# EAGLE design Atom S3 Module - Rev. C (EAGLE 9.6.2)

## Sheet 1 of 2: Power
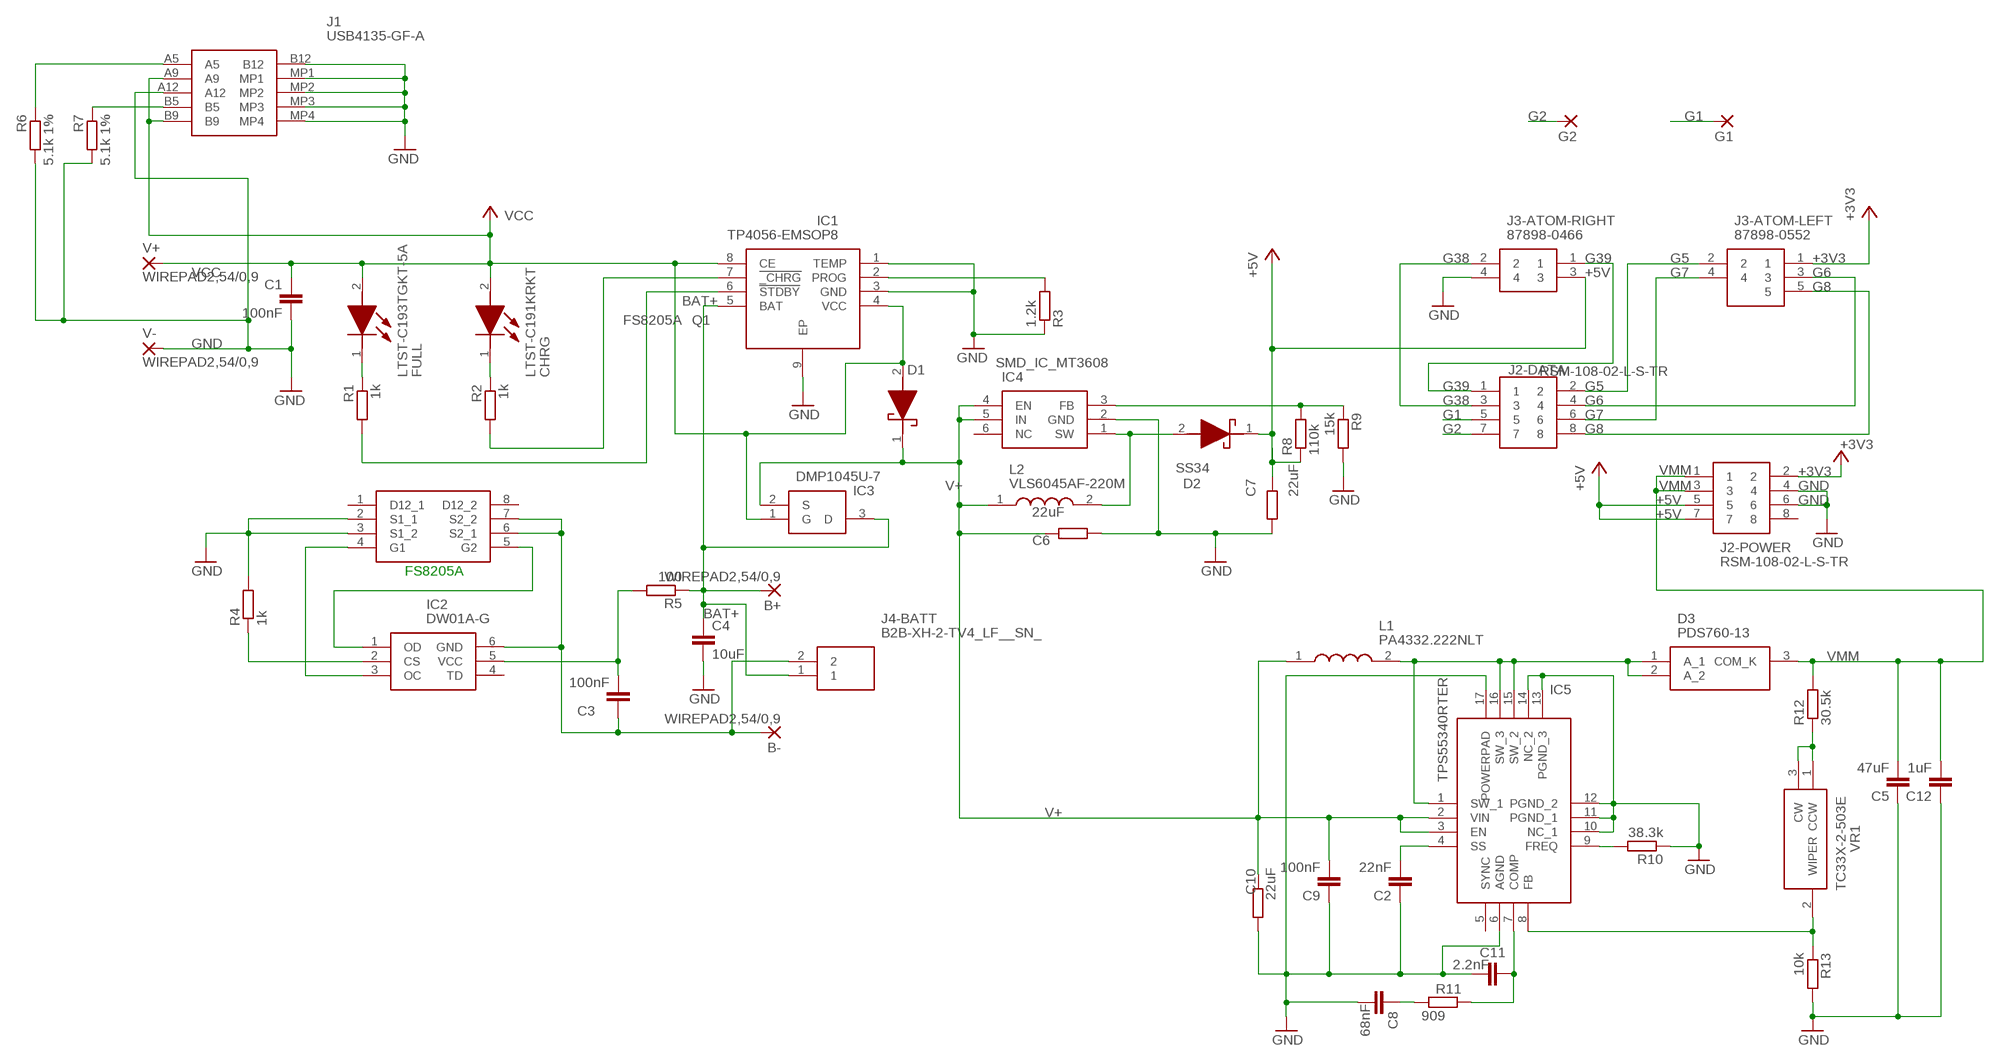
[diagram p0: schematic, sheet 1]

### Parts
B+  WIREPAD2,54/0,9  [2,54/0,9]
B-  WIREPAD2,54/0,9  [2,54/0,9]
C1  100nF  C-EUC0603  [C0603]
C2  22nF  C-EUC0603  [C0603]
C3  100nF  C-EUC0603  [C0603]
C4  10uF  C-EUC0603  [C0603]
C5  47uF  C-EUC1210  [C1210]
C6  22uF  R-EU_R0805  [R0805]
C7  22uF  R-EU_R0805  [R0805]
C8  68nF  C-EUC0603  [C0603]
C9  100nF  C-EUC0603  [C0603]
C10  22uF  R-EU_R0805  [R0805]
C11  2.2nF  C-EUC0603  [C0603]
C12  1uF  C-EUC0603  [C0603]
CHRG  LTST-C191KRKT  [LEDC1608X55N]
D1  SS34  [DIOM8059X256N]
D2  SS34  [DIOM8059X256N]
D3  PDS760-13  [PDS76013]
FULL  LTST-C193TGKT-5A  [LEDC1608X45N]
G1  WIREPAD1,6/0,9  [1,6/0,9]
G2  WIREPAD1,6/0,9  [1,6/0,9]
IC1  TP4056-EMSOP8  [SOP65P490X110-9N]
IC2  DW01A-G  [SOT95P190X145-6N]
IC3  DMP1045U-7  [SOT96P240X110-3N]
IC4  SMD_IC_MT3608  [SOT95P280X145-6N]
IC5  TPS55340RTER  [QFN50P300X300X80-17N]
J1  USB4135-GF-A  [USB4135GFA]
J2-DATA  RSM-108-02-L-S-TR  [RSM10802LSTR]
J2-POWER  RSM-108-02-L-S-TR  [RSM10802LSTR]
J3-ATOM-LEFT  87898-0552  [878980552]
J3-ATOM-RIGHT  87898-0466  [878980466]
J4-BATT  B2B-XH-2-TV4_LF__SN_  [B2BXH2TV4LFSN]
L1  PA4332.222NLT  [INDPM4042X200N]
L2  VLS6045AF-220M  [VLS6045]
Q1  FS8205A  [SOP65P640X120-8N]
R1  1k  R-EU_R0603  [R0603]
R2  1k  R-EU_R0603  [R0603]
R3  1.2k  R-EU_R0603  [R0603]
R4  1k  R-EU_R0603  [R0603]
R5  100  R-EU_R0603  [R0603]
R6  5.1k 1%  R-EU_R0603  [R0603]
R7  5.1k 1%  R-EU_R0603  [R0603]
R8  110k  R-EU_R0603  [R0603]
R9  15k  R-EU_R0603  [R0603]
R10  38.3k  R-EU_R0603  [R0603]
R11  909  R-EU_R0603  [R0603]
R12  30.5k  R-EU_R0805  [R0805]
R13  10k  R-EU_R0603  [R0603]
V+  WIREPAD2,54/0,9  [2,54/0,9]
V-  WIREPAD2,54/0,9  [2,54/0,9]
VR1  TC33X-2-503E  [TC33X2503E]

### Nets
+3V3: J2-POWER.2 J3-ATOM-LEFT.1
+5V [Power]: C7.2 D2.1(K) J2-POWER.5 J2-POWER.7 J3-ATOM-RIGHT.3 R8.1
BAT+ [Power]: B+.1(P) C4.1 IC1.5(BAT) IC3.3(D) J4-BATT.1 R5.1
BAT- [Power]: B-.1(P) C3.1 IC2.6(GND) J4-BATT.2 Q1.6(S2_1) Q1.7(S2_2)
G1: G1.1(P) J2-DATA.5
G2: G2.1(P) J2-DATA.7
G5: J2-DATA.2 J3-ATOM-LEFT.2
G6: J2-DATA.4 J3-ATOM-LEFT.3
G7: J2-DATA.6 J3-ATOM-LEFT.4
G8: J2-DATA.8 J3-ATOM-LEFT.5
G38: J2-DATA.3 J3-ATOM-RIGHT.2
G39: J2-DATA.1 J3-ATOM-RIGHT.1
GND [GND]: C1.2 C2.1 C4.2 C5.1 C6.1 C7.1 C8.2 C9.1 C10.1 C11.2 C12.1 IC1.1(TEMP) IC1.3(GND) IC1.9(EP) IC4.2(GND) IC5.6(AGND) IC5.10(NC_1) IC5.11(PGND_1) IC5.12(PGND_2) IC5.13(PGND_3) IC5.14(NC_2) IC5.17(POWERPAD) J1.A12 J1.B12 J1.MP1 J1.MP2 J1.MP3 J1.MP4 J2-POWER.4 J2-POWER.6 J3-ATOM-RIGHT.4 Q1.2(S1_1) Q1.3(S1_2) R3.1 R4.2 R6.2 R7.2 R9.2 R10.1 R13.2 V-.1(P)
N$1: FULL.1(K) R1.1
N$2: CHRG.1(K) R2.1
N$3: IC1.6(!STDBY) R1.2
N$4: IC1.7(!_CHRG) R2.2
N$5: IC2.3(OC) Q1.4(G1)
N$6: J1.B5 R7.1
N$7: IC1.2(PROG) R3.2
N$8: IC2.2(CS) R4.1
N$9: IC2.1(OD) Q1.5(G2)
N$10: D2.2(A) IC4.1(SW) L2.2
N$11: C3.2 IC2.5(VCC) R5.2
N$15: J1.A5 R6.1
N$16: IC5.9(FREQ) R10.2
N$17: IC4.3(FB) R8.2 R9.1
N$18: C11.1 IC5.7(COMP) R11.2
N$19: C8.1 R11.1
N$20: D3.1(A_1) D3.2(A_2) IC5.1(SW_1) IC5.15(SW_2) IC5.16(SW_3) L1.2
N$21: C2.2 IC5.4(SS)
N$24: R12.1 VR1.1(CCW) VR1.3(CW)
N$25: IC5.8(FB) R13.1 VR1.2(WIPER)
V+ [Power]: C6.2 C9.2 C10.2 D1.1(K) IC3.2(S) IC4.4(EN) IC4.5(IN) IC5.2(VIN) IC5.3(EN) L1.1 L2.1
VCC [Power]: C1.1 CHRG.2(A) D1.2(A) FULL.2(A) IC1.4(VCC) IC1.8(CE) IC3.1(G) J1.A9 J1.B9 V+.1(P)
VMM [Power]: C5.2 C12.2 D3.3(COM_K) J2-POWER.1 J2-POWER.3 R12.2
Unconnected: IC2.4(TD) IC4.6(NC) IC5.5(SYNC) J2-POWER.8 Q1.1(D12_1) Q1.8(D12_2)

### Notes on the sheet
- FS8205A

## Sheet 2 of 2

## Library data of the parts
B+ B- G1 G2 V+ V- = wirepad:WIREPAD: Wire PAD connect wire on PCB
C1-C5 C8 C9 C11 C12 = rcl:C-EU: CAPACITOR, European symbol; SPICEPREFIX: C
C6 C7 C10 R1-R13 = rcl:R-EU_: RESISTOR, European symbol; SPICEPREFIX: R
CHRG = SamacSys_Parts:LTST-C191KRKT: Standard LEDs - SMD Red Clear 631nm Source: Datasheet; DESCRIPTION: Standard LEDs - SMD Red Clear 631nm; HEIGHT: 0.55mm; MANUFACTURER_NAME: Lite-On; MANUFACTURER_PART_NUMBER: LTST-C191KRKT; MOUSER_PART_NUMBER: 859-LTST-C191KRKT; MOUSER_PRICE-STOCK: https://www.mouser.co.uk/ProductDetail/Lite-On/LTST-C191KRKT?qs=BAIUz4Y8PJBLfOhzue0q%252BA%3D%3D
D1 D2 = SamacSys_Parts:SS34: ON Semi SS34 SMT Schottky Diode, 40V 3A, 2-Pin DO-214AB Source: Datasheet <https://componentsearchengine.com/Datasheets/2/SS34.pdf>; DESCRIPTION: ON Semi SS34 SMT Schottky Diode, 40V 3A, 2-Pin DO-214AB; HEIGHT: 2.56mm; MANUFACTURER_NAME: onsemi; MANUFACTURER_PART_NUMBER: SS34; MOUSER_PART_NUMBER: 512-SS34; MOUSER_PRICE-STOCK: https://www.mouser.co.uk/ProductDetail/onsemi-Fairchild/SS34?qs=2ONuHmP%2FXzb3ub11UdFfdQ%3D%3D
D3 = SamacSys_Parts:PDS760-13: Diode Schottky 60V 7A 3Pin PowerDI 5 Diodes Inc PDS760-13, SMT Schottky Diode, 60V 7A, 3-Pin PowerDI 5 Source: Datasheet <https://www.diodes.com/assets/Datasheets/PDS760.pdf>; DESCRIPTION: Diode Schottky 60V 7A 3Pin PowerDI 5 Diodes Inc PDS760-13, SMT Schottky Diode, 60V 7A, 3-Pin PowerDI 5; HEIGHT: 1.15mm; MANUFACTURER_NAME: Diodes Incorporated; MANUFACTURER_PART_NUMBER: PDS760-13; MOUSER_PART_NUMBER: 621-PDS760-F; MOUSER_PRICE-STOCK: https://www.mouser.co.uk/ProductDetail/Diodes-Incorporated/PDS760-13?qs=%2FNF5U5UGuWlxwy7NIrHVWQ%3D%3D
FULL = SamacSys_Parts:LTST-C193TGKT-5A: Standard LEDs - SMD Green 525nm 90mcd 5mA Source: Datasheet <https://componentsearchengine.com/Datasheets/1/LTST-C193TGKT-5A.pdf>; DESCRIPTION: Standard LEDs - SMD Green 525nm 90mcd 5mA; HEIGHT: 0.45mm; MANUFACTURER_NAME: Lite-On; MANUFACTURER_PART_NUMBER: LTST-C193TGKT-5A; MOUSER_PART_NUMBER: 859-LTSTC193TGKT5A; MOUSER_PRICE-STOCK: https://www.mouser.co.uk/ProductDetail/Lite-On/LTST-C193TGKT-5A?qs=xIkB7y1OTopTMREQeh9vRQ%3D%3D
IC1 = SamacSys_Parts:TP4056-EMSOP8: nc Source: Datasheet <http://pdf1.alldatasheet.co.kr/datasheet-pdf/view/1140415/ASIC/TP4056X.html>; DESCRIPTION: nc; HEIGHT: 1.1mm; MANUFACTURER_NAME: TOP POWER; MANUFACTURER_PART_NUMBER: TP4056-EMSOP8
IC2 = SamacSys_Parts:DW01A-G: one cell lithium-ion/polymer battery protection IC Source: Datasheet <http://www.ic-fortune.com/upload/Download/DW01x-DS-17_EN.pdf>; DESCRIPTION: one cell lithium-ion/polymer battery protection IC; HEIGHT: 1.45mm; MANUFACTURER_NAME: SII Semiconductor; MANUFACTURER_PART_NUMBER: DW01A-G
IC3 = SamacSys_Parts:DMP1045U-7: P-Channel Enhancement MOSFET SOT-23 Diodes Inc DMP1045U-7 P-channel MOSFET Transistor, 5.2 A, -12 V, 3-Pin SOT23 Source: Datasheet <https://www.diodes.com//assets/Datasheets/DMP1045U.pdf>; DESCRIPTION: P-Channel Enhancement MOSFET SOT-23 Diodes Inc DMP1045U-7 P-channel MOSFET Transistor, 5.2 A, -12 V, 3-Pin SOT23; HEIGHT: 1.1mm; MANUFACTURER_NAME: Diodes Incorporated; MANUFACTURER_PART_NUMBER: DMP1045U-7; MOUSER_PART_NUMBER: 621-DMP1045U-7; MOUSER_PRICE-STOCK: https://www.mouser.co.uk/ProductDetail/Diodes-Incorporated/DMP1045U-7?qs=T%2FOtf55vL7eEKnIWhgMvTQ%3D%3D
IC4 = SamacSys_Parts:SMD_IC_MT3608: Switching Voltage Regulators Source: Datasheet; DESCRIPTION: Switching Voltage Regulators; HEIGHT: 1.45mm; MANUFACTURER_NAME: Olimex Ltd.; MANUFACTURER_PART_NUMBER: SMD IC MT3608; MOUSER_PART_NUMBER: 909-SMDICMT3608; MOUSER_PRICE-STOCK: https://www.mouser.co.uk/ProductDetail/Olimex-Ltd/SMD-IC-MT3608?qs=9vOqFld9vZUPP7qbovoiPg%3D%3D
IC5 = SamacSys_Parts:TPS55340RTER: TEXAS INSTRUMENTS - TPS55340RTER - DC/DC CONV, BOOST/SEPIC/FLYBACK, WQFN-16 Source: Datasheet <http://www.ti.com/general/docs/lit/getliterature.tsp?genericPartNumber=TPS55340&&fileType=pdf>; DESCRIPTION: TEXAS INSTRUMENTS - TPS55340RTER - DC/DC CONV, BOOST/SEPIC/FLYBACK, WQFN-16; HEIGHT: 0.8mm; MANUFACTURER_NAME: Texas Instruments; MANUFACTURER_PART_NUMBER: TPS55340RTER; MOUSER_PART_NUMBER: 595-TPS55340RTER; MOUSER_PRICE-STOCK: https://www.mouser.co.uk/ProductDetail/Texas-Instruments/TPS55340RTER?qs=N%2FGwOzoYEAAx6J14jB%2FDAA%3D%3D
J1 = SamacSys_Parts:USB4135-GF-A: USB Connectors USBC Rec GF RA 6P SMT-SMT stakes 3.16mm Source: Datasheet; DESCRIPTION: USB Connectors USBC Rec GF RA 6P SMT-SMT stakes 3.16mm; HEIGHT: 3.5mm; MANUFACTURER_NAME: GCT (GLOBAL CONNECTOR TECHNOLOGY); MANUFACTURER_PART_NUMBER: USB4135-GF-A; MOUSER_PART_NUMBER: 640-USB4135-GF-A; MOUSER_PRICE-STOCK: https://www.mouser.co.uk/ProductDetail/GCT/USB4135-GF-A?qs=Li%252BoUPsLEnt6HRo6RUvaXA%3D%3D
J2-DATA J2-POWER = SamacSys_Parts:RSM-108-02-L-S-TR: SAMTEC - RSM-108-02-L-S-TR - PCB Receptacle, Board-to-Board, 1.27 mm, 1 Rows, 8 Contacts, Surface Mount, RSM Series Source: Datasheet <https://suddendocs.samtec.com/prints/rsm-1xx-xx-xxx-s-x-xx-mkt.pdf>; DESCRIPTION: SAMTEC - RSM-108-02-L-S-TR - PCB Receptacle, Board-to-Board, 1.27 mm, 1 Rows, 8 Contacts, Surface Mount, RSM Series; HEIGHT: 6.1mm; MANUFACTURER_NAME: SAMTEC; MANUFACTURER_PART_NUMBER: RSM-108-02-L-S-TR; MOUSER_PART_NUMBER: 200-RSM10802LSTR; MOUSER_PRICE-STOCK: https://www.mouser.co.uk/ProductDetail/Samtec/RSM-108-02-L-S-TR?qs=rU5fayqh%252BE1Z8VnVeAb3Xg%3D%3D
J3-ATOM-LEFT = SamacSys_Parts:87898-0552: Headers & Wire Housings 2.54MM SRSW SMT HDR W/CAPT&R .05AULF5P Source: Datasheet <https://www.molex.com/pdm_docs/sd/878980552_sd.pdf>; DESCRIPTION: Headers & Wire Housings 2.54MM SRSW SMT HDR W/CAPT&R .05AULF5P; HEIGHT: 11.01mm; MANUFACTURER_NAME: Molex; MANUFACTURER_PART_NUMBER: 87898-0552
J3-ATOM-RIGHT = SamacSys_Parts:87898-0466: Headers & Wire Housings 2.54mm SRSW SMT Hd r W/O Cap 2.5SnL 4P Source: Datasheet <https://www.molex.com/pdm_docs/sd/878980466_sd.pdf>; DESCRIPTION: Headers & Wire Housings 2.54mm SRSW SMT Hd r W/O Cap 2.5SnL 4P; HEIGHT: 13.1mm; MANUFACTURER_NAME: Molex; MANUFACTURER_PART_NUMBER: 87898-0466; MOUSER_PART_NUMBER: 538-87898-0466; MOUSER_PRICE-STOCK: https://www.mouser.co.uk/ProductDetail/Molex/87898-0466?qs=Jo8FxELueakLmWG61uYedg%3D%3D
J4-BATT = SamacSys_Parts:B2B-XH-2-TV4_LF__SN_: Headers & Wire Housings XA HEADER ON RADIAL-TAPE (TOP TYPE) Source: Datasheet <https://www.jst-mfg.com/product/pdf/eng/eXH.pdf?674952ddde4ec>; DESCRIPTION: Headers & Wire Housings XA HEADER ON RADIAL-TAPE (TOP TYPE); HEIGHT: 7mm; MANUFACTURER_NAME: JST (JAPAN SOLDERLESS TERMINALS); MANUFACTURER_PART_NUMBER: B2B-XH-2-TV4(LF)(SN); MOUSER_PART_NUMBER: 306-B2BXH2TV4LFSN; MOUSER_PRICE-STOCK: https://www.mouser.co.uk/ProductDetail/JST-Commercial/B2B-XH-2-TV4LFSN?qs=QpmGXVUTftF%2FGUlNCb6%252BgQ%3D%3D
L1 = SamacSys_Parts:PA4332.222NLT: Inductor Power Shielded Drum Core 2.2uH 20% 1MHz 4.3A 48mOhm DCR 1515 T/R Source: Datasheet <https://datasheet.datasheetarchive.com/originals/distributors/DKDS-10/182650.pdf>; DESCRIPTION: Inductor Power Shielded Drum Core 2.2uH 20% 1MHz 4.3A 48mOhm DCR 1515 T/R; HEIGHT: 2mm; MANUFACTURER_NAME: Pulse Electronics; MANUFACTURER_PART_NUMBER: PA4332.222NLT; MOUSER_PART_NUMBER: 673-PA4332222NLT; MOUSER_PRICE-STOCK: https://www.mouser.co.uk/ProductDetail/Pulse-Electronics/PA4332.222NLT?qs=%2FzQKu7YvIMbE5ttuY4d%2Fzg%3D%3D
L2 = SamacSys_Parts:VLS6045AF-220M: SMD / SMT Inductors (Coils), L=22?H, L x W x T : Source: Datasheet <https://product.tdk.com/system/files/dam/doc/product/inductor/inductor/smd/catalog/inductor_commercial_power_vls6045af_en.pdf>; DESCRIPTION: SMD / SMT Inductors (Coils), L=22?H, L x W x T :; HEIGHT: mm; MANUFACTURER_NAME: TDK; MANUFACTURER_PART_NUMBER: VLS6045AF-220M; MOUSER_PART_NUMBER: 810-VLS6045AF-220M; MOUSER_PRICE-STOCK: https://www.mouser.co.uk/ProductDetail/TDK/VLS6045AF-220M?qs=lc2O%252BfHJPVaPRXMBSSNqgw%3D%3D
Q1 = SamacSys_Parts:FS8205A: dual n-channel enhancement mode power MOFSET Source: Datasheet <http://www.ic-fortune.com/upload/Download/FS8205A-DS-12_EN.pdf>; DESCRIPTION: dual n-channel enhancement mode power MOFSET; HEIGHT: 1.2mm; MANUFACTURER_NAME: SII Semiconductor; MANUFACTURER_PART_NUMBER: FS8205A
VR1 = SamacSys_Parts:TC33X-2-503E: SMD single turn trimmer 50K 25% top adj Bourns TC33 Series SMD Trimmer Resistor with Solder Pad Terminations, 50k +/-25% 0.1W +/-250ppm/C Top Adjust Source: Datasheet <https://componentsearchengine.com/Datasheets/1/TC33X-2-503E.pdf>; DESCRIPTION: SMD single turn trimmer 50K 25% top adj Bourns TC33 Series SMD Trimmer Resistor with Solder Pad Terminations, 50k +/-25% 0.1W +/-250ppm/C Top Adjust; HEIGHT: 1.2mm; MANUFACTURER_NAME: Bourns; MANUFACTURER_PART_NUMBER: TC33X-2-503E; MOUSER_PART_NUMBER: 652-TC33X-2-503E; MOUSER_PRICE-STOCK: https://www.mouser.co.uk/ProductDetail/Bourns/TC33X-2-503E?qs=tEaODSGlU8NgxHjveDtEEg%3D%3D

## Net classes
2 Power: width 0.203 mm

## Board
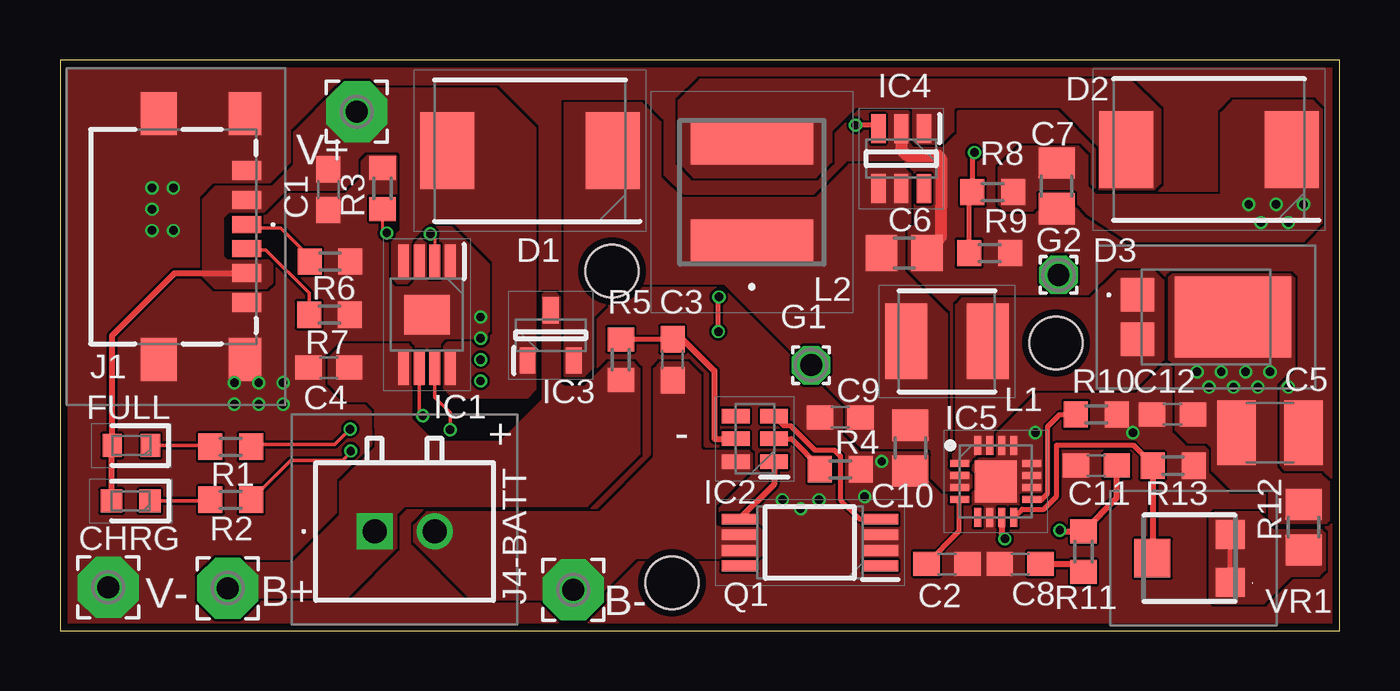
[diagram p1: board, top side]
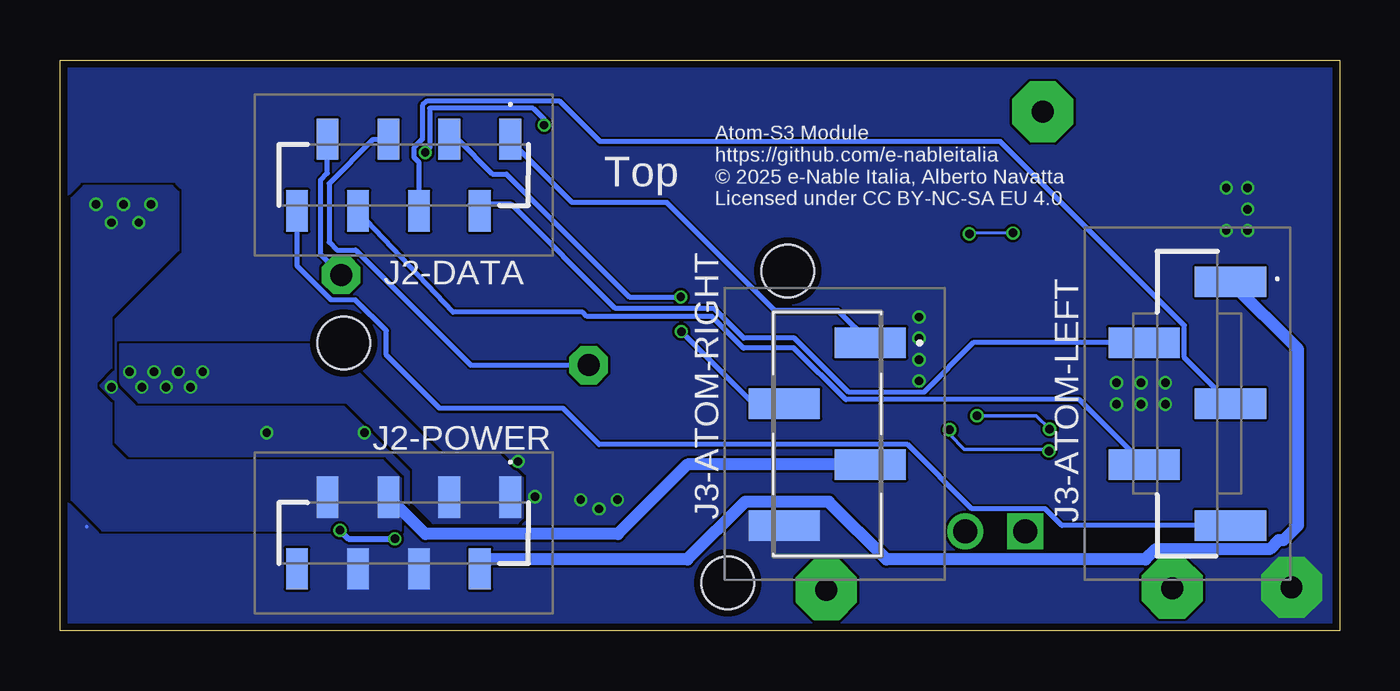
[diagram p2: board, bottom side, seen from below]

Size 53.32 x 23.8 mm. Coordinates in mm from the lower left corner, seen from the top.
Outline: 0,0 53.32,0 53.32,23.8 0,23.8 0,0
Copper layers (1*16): Top 0.035mm / dielectric 1.5mm / Bottom 0.035mm
Design rules "PCBWay_2L_100um-Track": minimum track width 0.1mm, minimum drill 0.3mm, track to track 0.1mm, track to pad 0.1mm, pad to pad 0.1mm, via to via 0.1mm, smd to smd 0mil, copper to edge 0.3mm, drill to drill 10mil, minimum pad ring 6mil, minimum via ring 0.1mm, stop-mask expansion 2mil, vias tented up to drill 0.45mm, thermal gap 0.2mm
Holes 2.2 mm at 25.5,2 41.5,12 23,15

### Footprints (pad centres in the part's own frame; a part is rotated, then mirrored left to right if it is on the bottom)
2,54/0,9 = drill 0.914 pad 2.54 octagon: 1 0,0
C0603 = smd 1.1 x 1: 1 -0.85,0; 2 0.85,0
C1210 = smd 1.6 x 2.7: 1 -1.4,0; 2 1.4,0
R0805 = smd 1.3 x 1.5: 1 -0.95,0; 2 0.95,0
LEDC1608X55N = smd 0.9 x 0.95: 1 -0.8,0; 2 0.8,0
DIOM8059X256N = smd 2.25 x 3.2: 1 -3.45,0; 2 3.45,0
PDS76013 = smd 1.4 x 1.39: 1 -2.856,0.92; 2 -2.856,-0.92 | smd 4.86 x 3.36: 3 1.126,0
LEDC1608X45N = smd 0.8 x 0.95: 1 -0.8,0; 2 0.8,0
1,6/0,9 = drill 0.914 pad 1.6 octagon: 1 0,0
SOP65P490X110-9N = smd 1.425 x 0.45: 1 -2.212,0.975; 2 -2.212,0.325; 3 -2.212,-0.325; 4 -2.212,-0.975; 5 2.212,-0.975; 6 2.212,-0.325; 7 2.212,0.325; 8 2.212,0.975 | smd 1.65 x 1.9: 9 0,0
SOT95P190X145-6N = smd 1.15 x 0.6: 1 -0.8,0.95; 2 -0.8,0; 3 -0.8,-0.95; 4 0.8,-0.95; 5 0.8,0; 6 0.8,0.95
SOT96P240X110-3N = smd 1.1 x 0.65: 1 -1.05,0.96; 2 -1.05,-0.96; 3 1.05,0
SOT95P280X145-6N = smd 1.2 x 0.6: 1 -1.25,0.95; 2 -1.25,0; 3 -1.25,-0.95; 4 1.25,-0.95; 5 1.25,0; 6 1.25,0.95
QFN50P300X300X80-17N = smd 0.8 x 0.3: 1 -1.5,0.75; 2 -1.5,0.25; 3 -1.5,-0.25; 4 -1.5,-0.75; 9 1.5,-0.75; 10 1.5,-0.25; 11 1.5,0.25; 12 1.5,0.75 | smd 0.3 x 0.8: 5 -0.75,-1.5; 6 -0.25,-1.5; 7 0.25,-1.5; 8 0.75,-1.5; 13 0.75,1.5; 14 0.25,1.5; 15 -0.25,1.5; 16 -0.75,1.5 | smd 1.76 x 1.76: 17 0,0
USB4135GFA = smd 0.7 x 1.2: A5 -0.5,3.055; B5 0.5,3.055 | smd 0.76 x 1.2: A9 1.52,3.055; B9 -1.52,3.055 | smd 0.8 x 1.2: A12 2.75,3.055; B12 -2.75,3.055 | smd 1.8 x 1.35: MP1 -5.125,2.98; MP2 5.125,2.98 | smd 1.8 x 1.5: MP3 -5.125,-0.6; MP4 5.125,-0.6
RSM10802LSTR = smd 0.91 x 1.715: 1 -4.445,-1.493; 2 -3.175,1.492; 3 -1.905,-1.493; 4 -0.635,1.492; 5 0.635,-1.493; 6 1.905,1.492; 7 3.175,-1.493; 8 4.445,1.492
878980552 = smd 1.27 x 2.96: 1 -5.08,1.8; 2 -2.54,-1.8; 3 0,1.8; 4 2.54,-1.8; 5 5.08,1.8
878980466 = smd 1.27 x 2.96: 1 -3.81,1.79; 2 -1.27,-1.79; 3 1.27,1.79; 4 3.81,-1.79
B2BXH2TV4LFSN = drill 1 pad 1.5 square: 1 0,0 | drill 1 pad 1.5: 2 -2.5,0
INDPM4042X200N = smd 1.75 x 3.15: 1 -1.7,0; 2 1.7,0
VLS6045 = smd 1.9 x 5.1: 1 -2.1,0; 2 2.1,0
SOP65P640X120-8N = smd 1.475 x 0.45: 1 -2.938,0.975; 2 -2.938,0.325; 3 -2.938,-0.325; 4 -2.938,-0.975; 5 2.938,-0.975; 6 2.938,-0.325; 7 2.938,0.325; 8 2.938,0.975
R0603 = smd 1 x 1.1: 1 -0.85,0; 2 0.85,0
TC33X2503E = smd 1.2 x 1.2: 1 -1,-1.7; 3 1,-1.7 | smd 1.6 x 1.5: 2 0,1.55

### Placement (x,y rotation side)
B+  6.99,1.78 0 top
B-  21.39,1.7 0 top
C1  11.18,18.39 270 top
C2  36.96,2.79 180 top
C3  25.53,11.3 90 top
C4  11.2,10.97 180 top
C5  50.42,8.26 180 top
C6  35.18,15.75 180 top
C7  41.53,18.54 90 top
C8  40.01,2.79 180 top
C9  32.51,8.89 0 top
C10  35.43,7.62 90 top
C11  43.18,6.88 180 top
C12  46.35,9.02 0 top
CHRG  2.95,5.41 180 top
D1  19.58,20.02 180 top
D2  47.88,20.07 180 top
D3  47.75,13.08 0 top
FULL  2.97,7.72 180 top
G1  31.29,11.07 0 top
G2  41.61,14.83 0 top
IC1  15.29,13.18 270 top
IC2  28.96,8 180 top
IC3  20.45,12.32 90 top
IC4  35.05,19.68 270 top
IC5  38.99,6.22 0 top
J1  4.72,16.43 270 top
J2-DATA  39,19 180 bottom
J2-POWER  39,4.08 180 bottom
J3-ATOM-LEFT  6.35,9.47 270 bottom
J3-ATOM-RIGHT  21.35,8.2 270 bottom
J4-BATT  13.11,4.14 180 top
L1  36.96,12.06 0 top
L2  28.83,18.29 90 top
Q1  31.24,3.68 180 top
R1  7.11,7.67 0 top
R2  7.11,5.46 0 top
R3  13.44,18.44 270 top
R4  32.51,6.73 0 top
R5  23.37,11.3 90 top
R6  11.25,15.39 0 top
R7  11.23,13.18 0 top
R8  38.86,18.29 180 top
R9  38.73,15.75 0 top
R10  43.18,9.02 180 top
R11  42.65,3.3 90 top
R12  51.82,4.32 90 top
R13  46.38,6.88 0 top
V+  12.37,21.64 0 top
V-  2.01,1.8 0 top
VR1  47.07,3.02 90 top

### Tracks (layer width: path | path; a pad name or v marks a point on that pad's centre or on a via)
+3V3
  Bottom 0.508: J3-ATOM-LEFT.1 1.73,11.73 1.73,4.39 2.35,3.77 2.55,3.77 2.92,3.4 6.18,3.4 7.66,3.4 8.09,2.97 18.87,2.97 21.28,5.38 24.77,5.38 27.18,2.97 35.45,2.97 J2-POWER.2
+5V  (via drill 0.35)
  Bottom 0.508: J3-ATOM-RIGHT.3 27.18,6.93 30.07,4.04 38.1,4.04 J2-POWER.5
  other vias: 49.53,17.78 50.67,17.78 51.82,17.78 51.18,17.02 50.04,17.02
  pour Top (no thermals): 52.2,22.1 52.58,21.72 52.58,17.02 51.82,16.26 49.28,16.26 48.39,17.14 48.39,21.59 48.9,22.1
  pour Top (no thermals): 40.01,20.19 42.42,20.19 42.8,19.81 42.8,18.54 43.18,18.16 48.51,18.16 48.51,17.65 49.91,16.26 44.55,16.26 42.8,17.4 42.42,17.78 42.42,18.31 42.29,18.44 40.79,18.44 40.64,18.29 40.64,17.65 40.51,17.53 39.37,17.53 39.12,17.78 39.12,19.3
  pour Bottom (no thermals): 48.39,18.29 48.64,18.54 52.32,18.54 52.83,18.03 52.83,5.46 51.56,4.19 39.12,4.19 39.12,6.35 39.88,7.11 50.55,7.11 51.18,7.75 51.18,9.47 51.82,10.11 51.82,10.34 51.18,10.97 51.18,13.08 48.39,15.88
BAT+
  pour Top (no thermals): 21.97,5.21 24.13,7.37 24.13,10.92 23.88,11.18 22.86,11.18 21.84,10.16 20.98,10.16 20.83,10.31 20.83,13.92 20.7,14.05 20.68,14.05 20.65,14.07 20.17,14.07 20.12,14.02 20.12,9.65 18.34,7.87 15.6,7.87 14.63,8.84 14.63,11.79 14.5,11.91 14.5,11.94 11.76,11.94 11.2,11.38 11.2,10.31 11.94,9.58 12.78,9.58 13.13,9.22 13.16,7.67 11.68,6.2 11.68,4.83 9.68,2.82 6.65,2.82 6.4,2.57 6.4,1.78 6.78,1.4 11.96,1.4 14.02,3.45 14.02,4.86 14.37,5.21
BAT-
  pour Top (no thermals): 14.76,3.71 14.76,4.39 15.29,4.93 22.48,4.93 22.48,4.93 24.77,7.24 24.77,10.92 25.02,11.18 26.16,11.18 26.67,10.67 26.67,7.62 26.8,7.49 28.7,7.49 28.83,7.37 28.83,6.73 27.3,5.21 27.3,4.45 27.43,4.32 29.08,4.32 29.21,4.19 29.21,3.17 29.08,3.05 24,3.05 22.28,1.32 17.14,1.32
G1
  Bottom 0.2: J2-DATA.5 40.26,20.49 42.11,18.65 42.11,16.2 41.78,15.87 41.01,15.87 36.21,11.07 G1.1
G2
  Bottom 0.2: J2-DATA.7 42.17,19.08 42.46,18.79 42.46,15.69 G2.1
G5
  Bottom 0.2: J2-DATA.2 36.23,17.78 34.52,17.78 30.18,13.44 26.07,13.44 24.84,12.21 22.72,12.21 20.45,9.94 17.33,9.94 15.26,12.01 J3-ATOM-LEFT.2
G6
  Bottom 0.2: J3-ATOM-LEFT.3 6.47,11.39 6.47,12.73 14.14,20.4 30.81,20.4 32.49,22.08 38.04,22.08 38.22,21.9 38.22,20.49 38.58,20.14 38.58,19.74 38.37,19.53 J2-DATA.4
G7
  Bottom 0.2: J2-DATA.6 36.94,13.28 31.54,13.28 31.37,13.11 26.16,13.11 24.84,11.79 22.73,11.79 22.72,11.78 20.58,9.64 10.86,9.64 J3-ATOM-LEFT.4
G8
  Bottom 0.2: J2-DATA.8 43.45,15.21 42.02,13.79 41.01,13.79 39.72,12.51 39.72,11.49 37.5,9.27 32.36,9.27 30.85,7.76 18,7.76 15.32,5.09 12.27,5.09 11.57,4.39 J3-ATOM-LEFT.5
G38  (via drill 0.35)
  Top 0.2: v27.43,12.47 27.43,13.89 v27.46,13.92
  Bottom 0.2: J2-DATA.3 36.75,20.49 35.31,19.05 34.72,19.05 29.59,13.92 v27.46,13.92 | J3-ATOM-RIGHT.2 24.43,9.47 v27.43,12.47
G39
  Bottom 0.2: J3-ATOM-RIGHT.1 20.91,13.36 23.53,13.36 28.03,17.86 31.98,17.86 34.55,20.43 J2-DATA.1
GND  (via drill 0.35)
  Top 0.508: IC4.2 35.05,20.07 35.31,19.81 36.58,19.81 36.71,19.68 36.71,17.67 36.7,17.66 36.7,16.42 C6.1
  Bottom 0.152: 52.2,4.34 52.2,4.33
  other vias: 7.26,10.34 8.28,10.34 9.3,10.34 7.26,9.45 8.28,9.45 9.3,9.45 17.53,13.08 17.53,12.19 17.53,11.3 17.53,10.41 44.7,8.26 40.64,8.26 51.18,10.16 4.72,16.69 3.84,16.69 3.84,17.58 3.84,18.47 4.72,18.47 34.24,7.06 33.53,5.59 31.62,5.46 30.86,5.08 30.1,5.46
  pour Bottom (rank 3, no thermals): 0.38,23.5 53.09,23.5 53.09,0.25 0.38,0.25 0.25,0.38 0.25,23.37
  pour Top (rank 3, no thermals): 0.38,23.62 53.09,23.62 53.21,23.5 53.21,0.25 53.09,0.13 0.25,0.13 0.13,0.25 0.13,23.62
N$1
  Top 0.152: FULL.1 6.21,7.72 R1.1
N$2
  Top 0.152: CHRG.1 6.21,5.41 R2.1
N$3  (via drill 0.35)
  Top 0.152: R1.2 8.06,7.77 11.46,7.77 v12.09,8.41 | IC1.6 14.97,9.11 v15.11,8.97
  Bottom 0.152: v12.09,8.41 12.65,8.97 v15.11,8.97
N$4  (via drill 0.35)
  Top 0.152: IC1.7 15.62,9.73 16.26,9.09 v16.26,8.38 | R2.2 9.61,7.11 11.79,7.11 12.14,7.47 v12.12,7.49
  Bottom 0.152: v12.12,7.49 12.19,7.57 15.65,7.57 16.26,8.18 v16.26,8.38
N$5
  Top 0.2: Q1.4 33.31,4.66 32.51,5.46 32.51,7.29 32.27,7.53 31.46,7.53 30.44,8.55 30.15,8.55 IC2.3
N$6
  Top 0.152: J1.B5 7.84,15.88 8.58,15.88 10.38,14.08 R7.1
N$7  (via drill 0.35)
  Top 0.127: R3.2 13.44,16.76 v13.61,16.59 | v15.43,16.55 15.62,16.36 IC1.2
  Bottom 0.127: v13.61,16.59 15.47,16.59 v15.43,16.55
N$8
  Top 0.2: IC2.2 30.48,8 31.66,6.82 R4.1
N$9
  Top 0.254: IC2.1 29.76,6.11 Q1.5
N$10
  pour Top (no thermals): 25.78,19.56 26.42,18.92 31.5,18.92 32.13,19.56 32.13,20.83 33.15,21.84 35.43,21.84 35.56,21.72 35.56,20.45 35.69,20.32 36.7,20.32 37.21,20.83 37.21,21.72 37.34,21.84 41.66,21.84 43.31,20.19 43.31,18.41 45.59,18.41 45.85,18.67 45.85,21.72 44.58,22.99 26.67,22.99 25.78,22.1
N$11
  Top 0.2: C3.2 R5.2
  Top 0.254: C3.2 25.95,12.15 27.27,10.83 27.27,8 IC2.5
N$15
  Top 0.152: J1.A5 7.92,16.79 9.19,16.79 10.4,15.58 R6.1
N$16
  Top 0.2: IC5.9 40.52,5.44 40.87,5.44 41.15,5.72 41.15,8.51 41.66,9.02 R10.2
N$17  (via drill 0.35)
  Top 0.2: IC4.3 33.95,21.08 v33.15,21.08 | v38.1,19.94 38.01,19.85 R8.2 37.88,18.16 R9.1
  Bottom 0.2: v38.1,19.94 37.92,20.12 37.92,21.78 33.6,21.78 33.15,21.32 v33.15,21.08
N$18  (via drill 0.35)
  Top 0.254: IC5.7 39.24,4.07 39.37,3.94 v39.37,3.83 | C11.1 44.03,5.54 R11.2 41.7,4.15 v41.66,4.19
  Bottom 0.254: v39.37,3.83 41.3,3.83 v41.66,4.19
N$19
  Top 0.254: C8.1 42.3,2.79 R11.1
N$20
  pour Top (no thermals): 37.34,13.59 37.34,7.49 37.21,7.37 37.21,6.99 37.85,6.99 38.23,7.37 38.86,7.37 38.86,8.31 40.61,10.06 44.73,10.06 45.97,11.3 45.97,14.61 45.59,14.99 44.07,14.99 42.93,13.84 37.59,13.84
N$21
  Top 0.2: IC5.4 37.46,5.44 37.46,4.14 C2.2
N$24
  Top 0.2: VR1.1 VR1.3
  pour Top (no thermals): 48.13,4.93 47.9,4.7 47.9,1.35 48.11,1.14 50.16,1.14 51.31,2.29 52.45,2.29 52.7,2.54 52.7,4.06 52.58,4.19 50.55,4.19 50.16,4.57 50.16,4.7 49.94,4.93
N$25
  Top 0.2: IC5.8 40.09,5.07 40.99,5.07 41.53,5.61 41.53,6.7 41.53,7.75 44.72,7.75 45.53,6.93 R13.1
  Top 0.254: R13.1 45.53,3.04 VR1.2
V+
  pour Top (no thermals): 24.23,22 21.03,22 21.03,10.64 21.06,10.62 21.84,10.62 22.23,11 22.23,13.08 23.62,14.48 27.69,14.48 32.77,9.4 32.77,8.26 33.4,7.62 36.2,7.62 36.32,7.49 36.32,6.35 36.83,5.84 37.85,5.84 37.97,5.97 37.97,6.48 37.85,6.6 37.08,6.6 36.96,6.73 36.96,13.21 35.18,14.99 35.18,16.76 35.43,17.02 35.43,19.05 35.05,19.43 32.89,19.43 31.5,18.03 25.91,18.03 25.02,18.92 25.02,21.21
VCC
  Top 0.254: CHRG.2 2.15,7.7 FULL.2 2.17,12.31 4.78,14.91 J1.A9
  pour Top (no thermals): 6.45,14.3 8.61,14.3 8.84,14.53 8.84,15.32 8.74,15.42 6.96,15.42 6.78,15.6 6.78,17.22 7.06,17.5 8.51,17.5 9.42,18.41 11.81,18.41 12.4,19 12.4,19.68 12.73,20.02 14.07,20.02 14.2,19.89 14.2,16.69 13.84,16.33 13.84,14.73 14.05,14.53 14.48,14.53 14.63,14.68 14.63,16.28 15.39,17.04 16.41,17.04 18.06,15.39 18.06,12.45 18.08,12.42 17.65,11.99 16.15,11.99 16,11.84 16,10.11 16.36,9.75 19.48,9.75 19.81,10.08 19.81,20.95 18.19,22.58 11.56,22.58 9.75,20.78 9.75,19.41 8.84,18.49 6.48,18.49 5.97,17.98 5.97,14.78
VMM  (via drill 0.35)
  other vias: 48.39,10.79 47.37,10.79 49.4,10.79 50.42,10.79 47.88,10.16 48.9,10.16 49.91,10.16
  pour Top (no thermals): 46.35,14.86 46.23,14.73 46.23,11.3 46.48,11.05 46.48,8.38 47.02,7.85 47.78,7.85 48.01,7.62 48.01,6.68 48.84,5.84 50.39,5.84 50.39,4.7 50.6,4.5 52.76,4.5 52.86,4.6 52.86,6.2 52.53,6.53 50.95,6.53 50.67,6.81 50.67,10.29 51.44,11.05 51.44,14.69 51.27,14.86
  pour Bottom (no thermals): 34.04,6.38 34.04,4.7 34.24,4.5 37.8,4.5 38.61,5.31 38.61,6.73 41.4,9.53 50.04,9.53 50.8,10.29 50.8,11.94 42.04,11.94 37.41,7.32 34.98,7.32

### Text on the board
tNames: + | -
bNames: ⇦ Top | Atom-S3 Module / https://github.com/e-nableitalia / © 2025 e-Nable Italia, Alberto Navatta / Licensed under CC BY-NC-SA EU 4.0
201bmp: C:/Users/anavatta/Desktop/by-nc-sa.eu.bmp | C:/Users/anavatta/Desktop/by-nc-sa.eu.bmp